# EAGLE design shiftregisters (EAGLE 6.6.0)
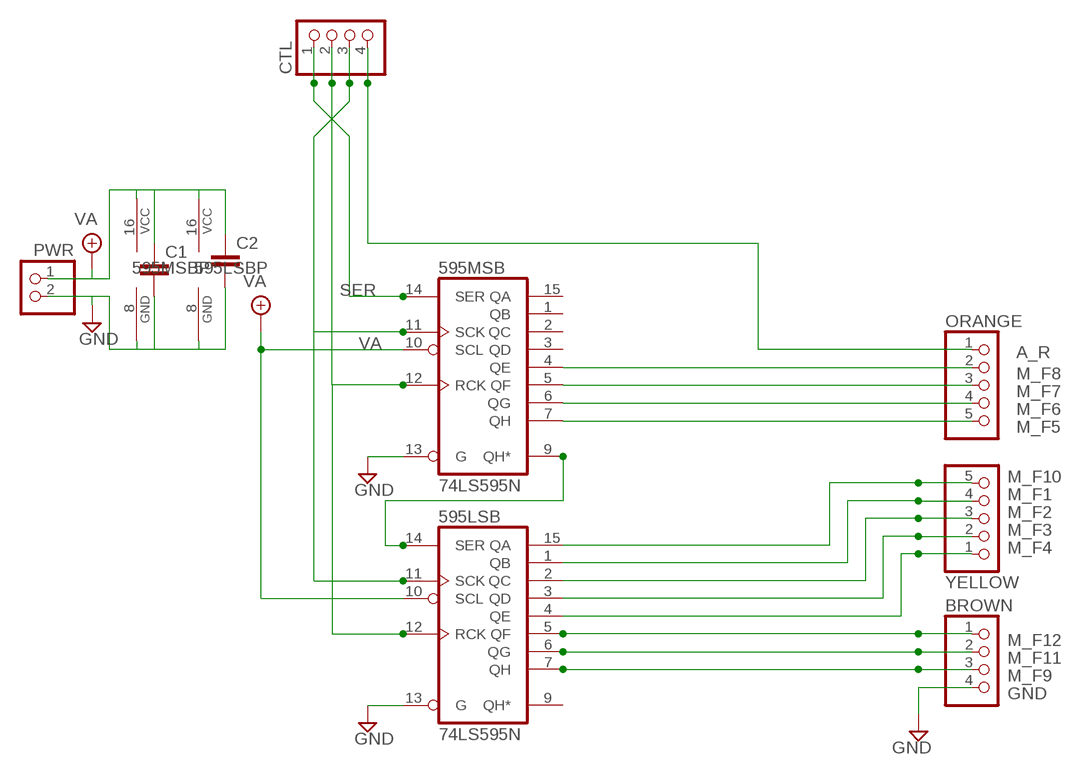
[diagram p0: schematic, sheet 1]

## Parts
595LSB  74LS595N  [DIL16]
595MSB  74LS595N  [DIL16]
BROWN  PINHD-1X4  [1X04]
C1  050X030_0251  [050X030_025]
C2  050X030_0251  [050X030_025]
CTL  PINHD-1X4  [1X04]
ORANGE  PINHD-1X5  [1X05]
PWR  PINHD-1X2  [1X02]
YELLOW  PINHD-1X5  [1X05]

## Nets
D5: CTL.4 ORANGE.1
GND: 595LSB.8(GND) 595LSB.13(G) 595MSB.8(GND) 595MSB.13(G) BROWN.4 C1.2 C2.2 PWR.2
M_F1: 595LSB.1(QB) YELLOW.4
M_F2: 595LSB.2(QC) YELLOW.3
M_F3: 595LSB.3(QD) YELLOW.2
M_F4: 595LSB.4(QE) YELLOW.1
M_F5: 595MSB.7(QH) ORANGE.5
M_F6: 595MSB.6(QG) ORANGE.4
M_F7: 595MSB.5(QF) ORANGE.3
M_F8: 595MSB.4(QE) ORANGE.2
M_F9: 595LSB.7(QH) BROWN.3
M_F10: 595LSB.15(QA) YELLOW.5
M_F11: 595LSB.6(QG) BROWN.2
M_F12: 595LSB.5(QF) BROWN.1
N$2: 595LSB.14(SER) 595MSB.9(QH*)
RCK: 595LSB.12(RCK) 595MSB.12(RCK) CTL.2
SCK: 595LSB.11(SCK) 595MSB.11(SCK) CTL.3
SER: 595MSB.14(SER) CTL.1
VA: 595LSB.10(SCL) 595LSB.16(VCC) 595MSB.10(SCL) 595MSB.16(VCC) C1.1 C2.1 PWR.1
Unconnected: 595LSB.9(QH*) 595MSB.1(QB) 595MSB.2(QC) 595MSB.3(QD) 595MSB.15(QA)

## Notes on the sheet
- A_R

## Library data of the parts
595LSB 595MSB = 74xx-us:74*595: 8-bit SHIFT REGISTER, output latch
BROWN CTL = pinhead:PINHD-1X4: PIN HEADER
C1 C2 = gm-caps-ceramic:050X030_025: 47 - 120pF Xicon Ceramic Disc 2.5mm lead spacing
ORANGE YELLOW = pinhead:PINHD-1X5: PIN HEADER
PWR = pinhead:PINHD-1X2: PIN HEADER

## Board
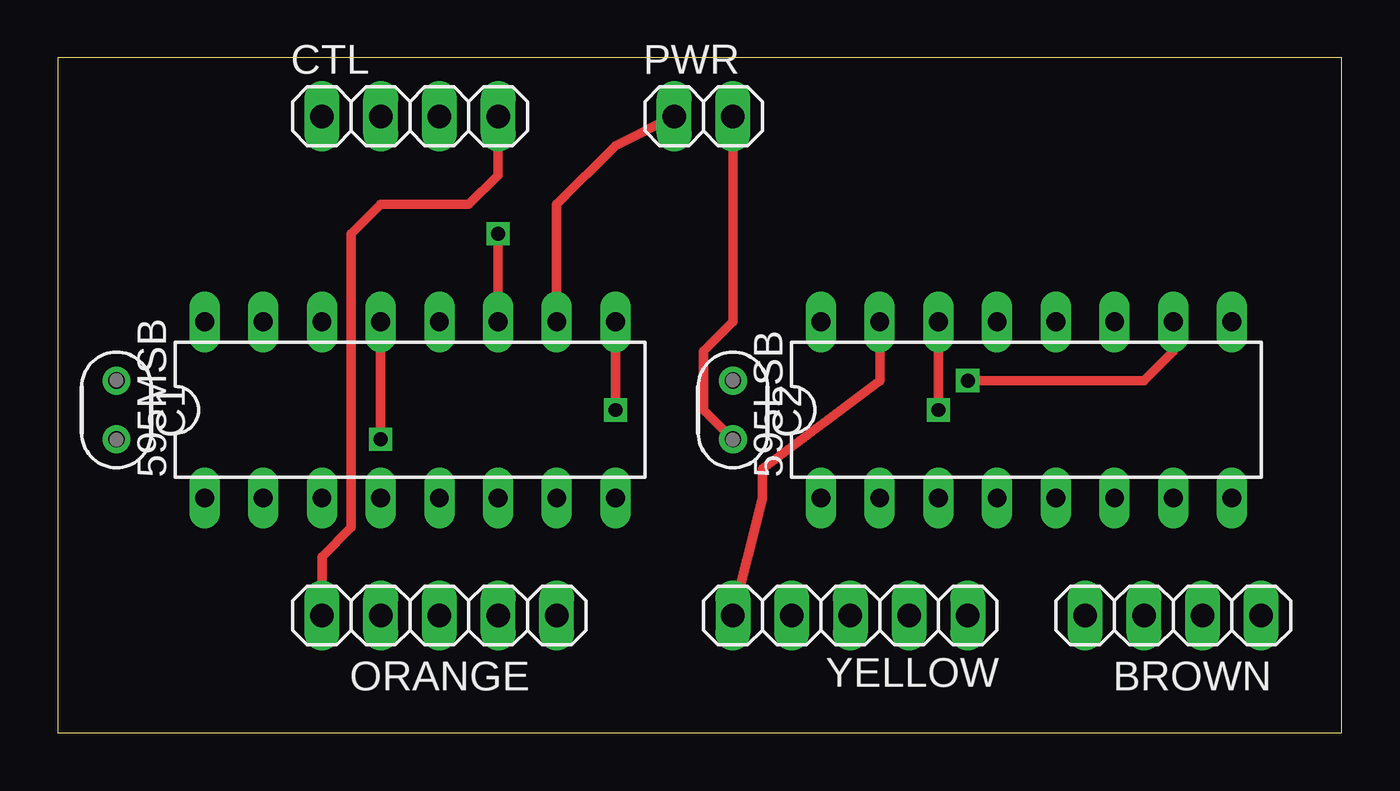
[diagram p1: board, top side]
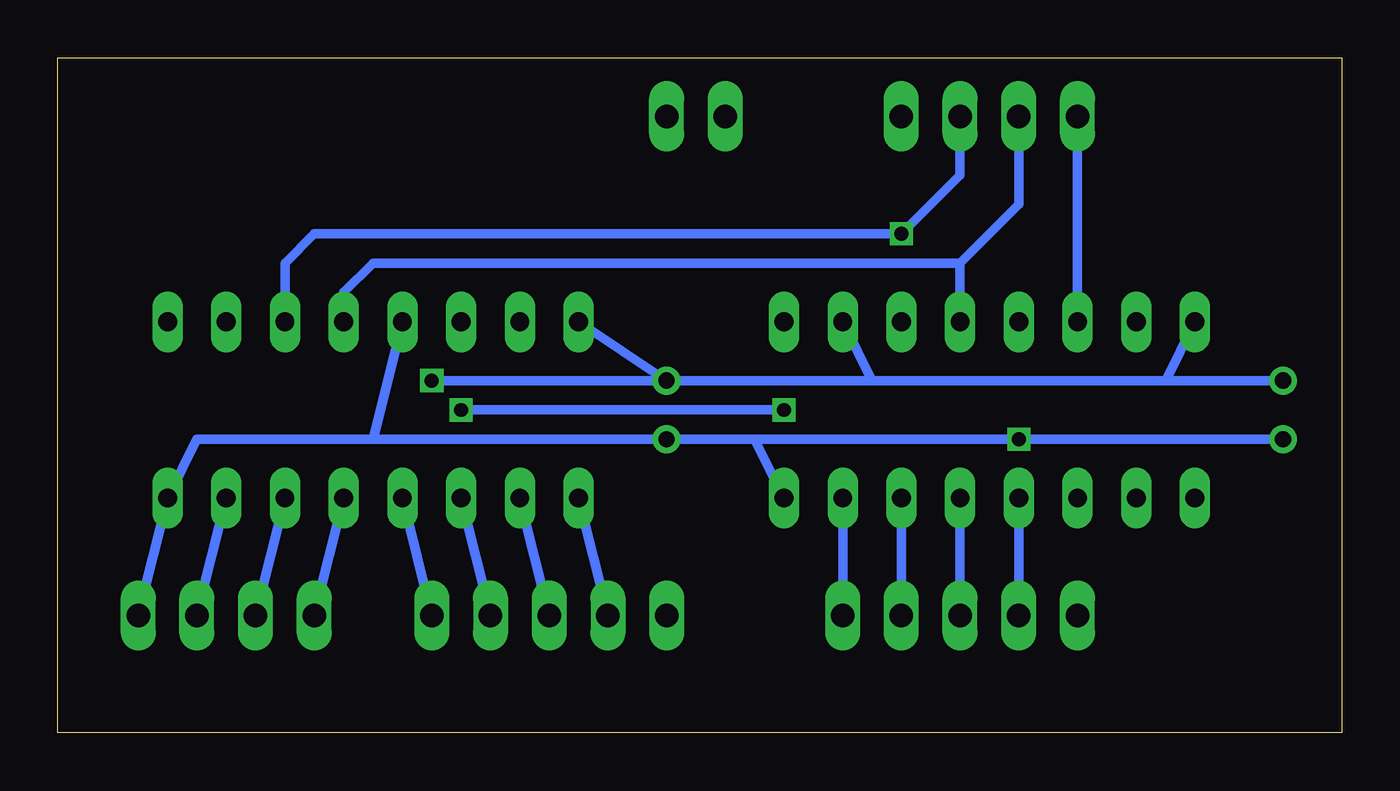
[diagram p2: board, bottom side, seen from below]

Size 55.55 x 29.2 mm. Coordinates in mm from the lower left corner, seen from the top.
Outline: 0,0 55.55,0 55.55,29.2 0,29.2 0,0
Copper layers (1*16): Top 0.035mm / dielectric 1.5mm / Bottom 0.035mm
Design rules "default": minimum track width 10mil, minimum drill 24mil, track to track 8mil, track to pad 8mil, pad to pad 8mil, via to via 8mil, smd to smd 8mil, copper to edge 40mil, drill to drill 8mil, minimum pad ring 10mil, minimum via ring 8mil, stop-mask expansion 4mil, vias tented up to drill 0mil, thermal gap 10mil

### Footprints (pad centres in the part's own frame; a part is rotated, then mirrored left to right if it is on the bottom)
DIL16 = drill 0.813 long: 1 -8.89,-3.81; 2 -6.35,-3.81; 3 -3.81,-3.81; 4 -1.27,-3.81; 5 1.27,-3.81; 6 3.81,-3.81; 7 6.35,-3.81; 8 8.89,-3.81; 9 8.89,3.81; 10 6.35,3.81; 11 3.81,3.81; 12 1.27,3.81; 13 -1.27,3.81; 14 -3.81,3.81; 15 -6.35,3.81; 16 -8.89,3.81
1X04 = drill 1.016 long: 1 -3.81,0; 2 -1.27,0; 3 1.27,0; 4 3.81,0
050X030_025 = drill 0.7: 1 -1.27,0; 2 1.27,0
1X05 = drill 1.016 long: 1 -5.08,0; 2 -2.54,0; 3 0,0; 4 2.54,0; 5 5.08,0
1X02 = drill 1.016 long: 1 -1.27,0; 2 1.27,0

### Placement (x,y rotation side)
595LSB  41.91,13.97 0 top
595MSB  15.24,13.97 0 top
BROWN  48.26,5.08 0 top
C1  2.54,13.97 270 top
C2  29.21,13.97 270 top
CTL  15.24,26.67 0 top
ORANGE  16.51,5.08 0 top
PWR  27.94,26.67 0 top
YELLOW  34.29,5.08 180 top

### Tracks (layer width: path | path; a pad name or v marks a point on that pad's centre or on a via)
D5
  Top 0.406: ORANGE.1 11.43,7.62 12.7,8.89 12.7,21.59 13.97,22.86 17.78,22.86 19.05,24.13 CTL.4
GND  (via drill 0.6)
  Top 0.406: 595MSB.13 v13.97,12.7 | C2.2 27.94,13.97 27.94,16.51 29.21,17.78 PWR.2
  Bottom 0.406: BROWN.4 595LSB.8 49.53,12.7 41.91,12.7 | 595LSB.13 41.91,12.7 | 41.91,12.7 C2.2 25.4,12.7 | 25.4,12.7 v13.97,12.7 C1.2 | 595MSB.8 25.4,12.7
M_F1
  Bottom 0.406: 595LSB.1 YELLOW.4
M_F2
  Bottom 0.406: 595LSB.2 YELLOW.3
M_F3
  Bottom 0.406: YELLOW.2 595LSB.3
M_F4
  Bottom 0.406: YELLOW.1 595LSB.4
M_F5
  Bottom 0.406: 595MSB.7 ORANGE.5
M_F6
  Bottom 0.406: 595MSB.6 ORANGE.4
M_F7
  Bottom 0.406: ORANGE.3 595MSB.5
M_F8
  Bottom 0.406: 595MSB.4 ORANGE.2
M_F9
  Bottom 0.406: 595LSB.7 BROWN.3
M_F10
  Top 0.406: 595LSB.15 35.56,15.24 30.48,11.43 30.48,10.16 YELLOW.5
M_F11
  Bottom 0.406: BROWN.2 595LSB.6
M_F12
  Bottom 0.406: 595LSB.5 BROWN.1
N$2  (via drill 0.6)
  Top 0.406: 595MSB.9 v24.13,13.97 | v38.1,13.97 595LSB.14
  Bottom 0.406: v24.13,13.97 v38.1,13.97
RCK
  Bottom 0.406: 595MSB.12 16.51,20.32 | 16.51,20.32 41.91,20.32 43.18,19.05 595LSB.12 | 16.51,20.32 13.97,22.86 CTL.2
SCK  (via drill 0.6)
  Top 0.406: v19.05,21.59 595MSB.11
  Bottom 0.406: 595LSB.11 45.72,20.32 44.45,21.59 v19.05,21.59 16.51,24.13 CTL.3
SER
  Bottom 0.406: 595MSB.14 CTL.1
VA  (via drill 0.6)
  Top 0.406: 595MSB.10 21.59,22.86 24.13,25.4 PWR.1 | v39.37,15.24 46.99,15.24 48.26,16.51 595LSB.10
  Bottom 0.406: 595MSB.16 7.62,15.24 | 7.62,15.24 20.32,15.24 | 20.32,15.24 595MSB.10 | C2.1 20.32,15.24 | 595LSB.16 C2.1 | C2.1 v39.37,15.24 | C1.1 7.62,15.24